# Altium schematic sheet NILINET_RFT.SchDoc
size A3
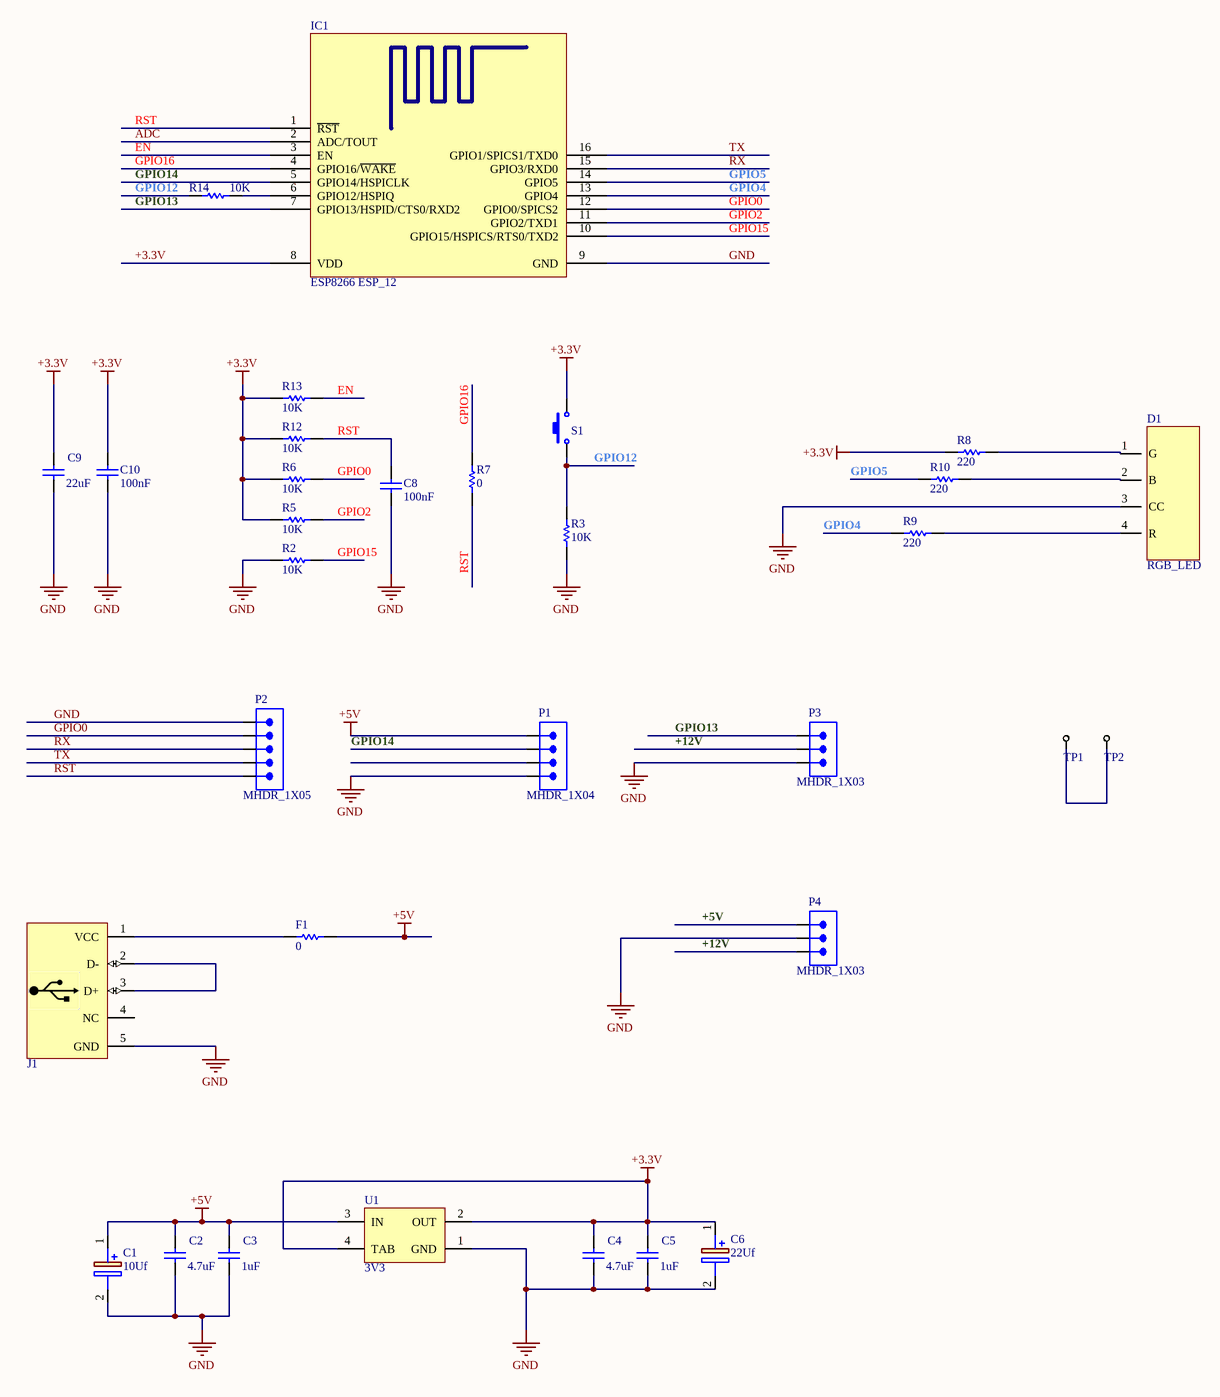
[diagram p0: NILINET_RFT.SchDoc]

## Parts
C1  10Uf  [UWT(4X5.4)]
C2  4.7uF  [CAP0805]
C3  1uF  [CAP0805]
C4  4.7uF  [CAP0805]
C5  1uF  [CAP0805]
C6  22Uf  [UWT(4X5.4)]
C8  100nF  [CAP0805]
C9  22uF  [CAP0805]
C10  100nF  [CAP0805]
D1  RGB_LED  [RGB_LED]
F1  0  [RES0805]
IC1  ESP8266 ESP_12  [ESP8266 ESP_12]
J1  USB Connector  [MicroUSB111]  (value not drawn)
P1  MHDR_1X04  [MHDR1X04-254P]
P2  MHDR_1X05  [MHDR1X05-254P]
P3  MHDR_1X03  [MHDR1X03-254P]
P4  MHDR_1X03  [MHDR1X03-254P]
R2  10K  [RES0805]
R3  10K  [RES0805]
R5  10K  [RES0805]
R6  10K  [RES0805]
R7  0  [RES0805]
R8  220  [RES0805]
R9  220  [RES0805]
R10  220  [RES0805]
R12  10K  [RES0805]
R13  10K  [RES0805]
R14  10K  [RES0805]
S1  Switch PB  [SwitchRight]  (value not drawn)
TP1  Test Point  [Test Point]  (value not drawn)
TP2  Test Point  [Test Point]  (value not drawn)
U1  3V3  [SOT223]

## Nets
+3.3V: C4.2 C5.2 C6.1(+) C9.2 C10.2 IC1.8(VDD) R5.2 R6.2 R8.1 R12.2 R13.2 S1.2 U1.2(OUT) U1.4(TAB)
+5V: C1.1(+) C2.2 C3.2 F1.1 P1.1 P4.1 U1.3(IN)
GND: C1.2(-) C2.1 C3.1 C4.1 C5.1 C6.2(-) C8.1 C9.1 C10.1 D1.3(CC) IC1.9(GND) J1.5(GND) P1.4 P2.1 P3.3 P4.2 R2.2 R3.2 U1.1(GND)
+12V: P3.2 P4.3
ADC: IC1.2(ADC/TOUT)
EN: IC1.3(EN) R13.1
GPIO0: IC1.12(GPIO0/SPICS2) P2.2 R6.1
GPIO2: IC1.11(GPIO2/TXD1) R5.1
GPIO4: IC1.13(GPIO4) R9.1
GPIO5: IC1.14(GPIO5) R10.1
GPIO12: R3.1 R14.2 S1.1
GPIO13: IC1.7(GPIO13/HSPID/CTS0/RXD2) P3.1
GPIO14: IC1.5(GPIO14/HSPICLK) P1.2
GPIO15: IC1.10(GPIO15/HSPICS/RTS0/TXD2) R2.1
GPIO16: IC1.4(GPIO16/~{WAKE}) R7.1
RST: C8.2 IC1.1(~{RST}) P2.5 R7.2 R12.1
RX: IC1.15(GPIO3/RXD0) P2.3
TX: IC1.16(GPIO1/SPICS1/TXD0) P2.4
NetD1_1: D1.1(G) R8.2
NetD1_2: D1.2(B) R10.2
NetD1_4: D1.4(R) R9.2
NetF1_2: F1.2 J1.1(VCC)
NetIC1_6: IC1.6(GPIO12/HSPIQ) R14.1
NetJ1_2: J1.2(D-) J1.3(D+)
NetTP1_1: TP1.1(T) TP2.1(T)

Not connected (* = marked no-connect by the designer): J1 4(NC); P1 3

## Library data of the parts
C1 C6 = UWT1C100MCL1GB: Capacitor Polarised; Manufacturer_Name: Nichicon; Allied_Number: 70409828; Datasheet Link: http://www.nichicon.co.jp/english/products/pdfs/e-uwt.pdf; Manufacturer_Part_Number: UWT1C100MCL1GB; Mouser Part Number: 647-UWT1C100MCL1B; Mouser Price/Stock: https://www.mouser.co.uk/ProductDetail/Nichicon/UWT1C100MCL1GB?qs=VVKQmw408U%252BpNF7TgczwPw%3D%3D; RS Part Number: 5201854P; RS Price/Stock: http://uk.rs-online.com/web/p/products/5201854P; Allied Price/Stock: https://www.alliedelec.com/nichicon-uwt1c100mcl1gb/70409828/
C2-C5 C9 = CAP SMD PACKAGE: TOTAL CAPACITOR SMD PACK; Designer: Abbas Basereh; Desc.: CAP SMD TOTAL PACKAGES; VALUE: 100nF; Data: 2017-3-10
C8 C10 = CAP SMD PACKAGE: TOTAL CAPACITOR SMD PACK; Designer: Abbas Basereh; Desc.: CAP SMD TOTAL PACKAGES; Data: 2017-3-10; VALUE: 100nF
F1 R2 R3 R5-R10 R12-R14 = RES SMD PACKAGE: TOTAL SMD RESISTOR PACK; Designer: Abbas Basereh; Desc.: RES SMD PAKAGES; Data: 2017-3-10
IC1 = ESP8266 ESP_12: ESP8266 ESP-12; IC: ESP8266-EX; Vendor: Ai-thinker; LatestReviewer: Zion Blue; Published: 14-Apr-2015; Publisher: Cynetik Group; LatestRevisionData: 14-Apr-2015; LatestRevisionNote: Include 3D body and Footprint
J1 = USB MICRO: USB Connector MICRO-B Type; Designer: ABBAS BASEREH; Max Current: 1600mA; Mounting Technology: Surface Mount\Through-Hole; Category: Connector; Pin Count: 5-7; Publisher: ABBAS BASEREH; Status: Unreleased; ComponentLink1Description: Datasheet; ComponentLink2Description: Reference; Update: 1395-11-17
P1 = MHDR_1X04: Male Header 1X04
P2 = MHDR_1X05: Male Header 1X05
P3 P4 = MHDR_1X03: Male Header 1X03
S1 = Switch PB: Push Button Switch
U1 = AMS1117-x.x: x.x Volt, 800mA Low-Dropout Linear Regulator, 4-pin SOT-223; Designer: Ali Hafizi; Data: 16-12-2016